# Altium project COMECA.PrjPcb
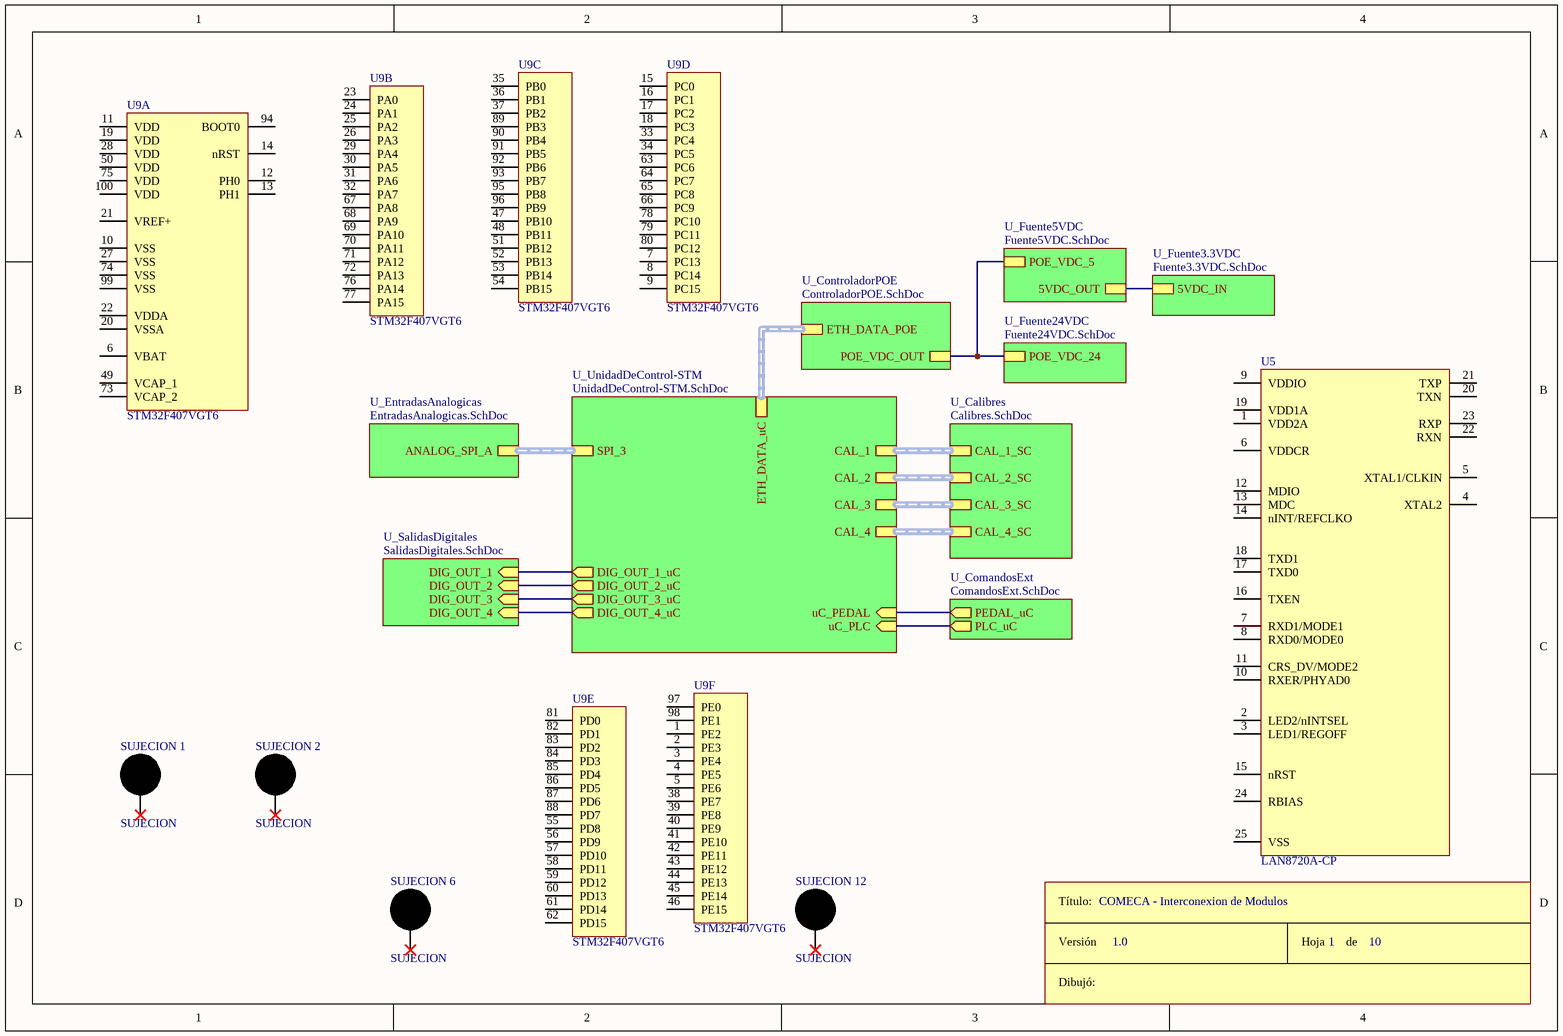
[diagram p0: COMECA_Main.SchDoc]
3 sheets, 38 parts. Net scope: hierarchical (ports join the sheet entries above them; power ports are global).
Board file: COMECA-PCBv1.PcbDoc
Sheets:
  COMECA_Main.SchDoc
    U_ControladorPOE = ControladorPOE.SchDoc
    U_ComandosExt = ComandosExt.SchDoc

## Sheet COMECA_Main.SchDoc
size A4; SheetNumber: 1; SheetTotal: 10

### Parts
ROT9  Rótulo  (value not drawn)  (graphical)
SUJECION_1  SUJECION  [SUJECION (5.00MM - 3.50MM)]
SUJECION_2  SUJECION  [SUJECION (5.00MM - 3.50MM)]
SUJECION_6  SUJECION  [SUJECION (5.00MM - 3.50MM)]
SUJECION_12  SUJECION  [SUJECION (5.00MM - 3.50MM)]
U5  LAN8720A-CP  [MC 24-QFN-PUNCH]
U9  STM32F407VGT6  [LQFP-100]  (parts A,B,C,D,E,F of 6)

### Sub-sheets
U_Calibres = Calibres.SchDoc (file not in this document): CAL_4_SC (harness CALIBRE), CAL_3_SC (harness CALIBRE), CAL_2_SC (harness CALIBRE), CAL_1_SC (harness CALIBRE)
U_ComandosExt = ComandosExt.SchDoc: PLC_uC (out), PEDAL_uC (out)
U_ControladorPOE = ControladorPOE.SchDoc: POE_VDC_OUT, ETH_DATA_POE (harness ETH_DATA)
U_EntradasAnalogicas = EntradasAnalogicas.SchDoc (file not in this document): ANALOG_SPI_A (harness ANALOG_SPI)
U_Fuente3.3VDC = Fuente3.3VDC.SchDoc (file not in this document): 5VDC_IN
U_Fuente5VDC = Fuente5VDC.SchDoc (file not in this document): POE_VDC_5, 5VDC_OUT
U_Fuente24VDC = Fuente24VDC.SchDoc (file not in this document): POE_VDC_24
U_SalidasDigitales = SalidasDigitales.SchDoc (file not in this document): DIG_OUT_4 (in), DIG_OUT_2 (in), DIG_OUT_3 (in), DIG_OUT_1 (in)
U_UnidadDeControl-STM = UnidadDeControl-STM.SchDoc (file not in this document): uC_PLC (in), uC_PEDAL (in), SPI_3 (harness ANALOG_SPI), CAL_2 (harness CALIBRE), CAL_3 (harness CALIBRE), CAL_4 (harness CALIBRE), CAL_1 (harness CALIBRE), DIG_OUT_3_uC (out), DIG_OUT_2_uC (out), DIG_OUT_1_uC (out), DIG_OUT_4_uC (out), ETH_DATA_uC (harness ETH_DATA)

### Nets
VDD: sheet U_ControladorPOE/POE_VDC_OUT, sheet U_Fuente5VDC/POE_VDC_5, sheet U_Fuente24VDC/POE_VDC_24
NetR7_1: sheet U_ComandosExt/PLC_uC, sheet U_UnidadDeControl-STM/uC_PLC
NetR10_1: sheet U_ComandosExt/PEDAL_uC, sheet U_UnidadDeControl-STM/uC_PEDAL
(unnamed): sheet U_Fuente5VDC/5VDC_OUT, sheet U_Fuente3.3VDC/5VDC_IN
(unnamed): sheet U_UnidadDeControl-STM/DIG_OUT_3_uC, sheet U_SalidasDigitales/DIG_OUT_3
(unnamed): sheet U_UnidadDeControl-STM/DIG_OUT_2_uC, sheet U_SalidasDigitales/DIG_OUT_2
(unnamed): sheet U_UnidadDeControl-STM/DIG_OUT_1_uC, sheet U_SalidasDigitales/DIG_OUT_1
(unnamed): sheet U_UnidadDeControl-STM/DIG_OUT_4_uC, sheet U_SalidasDigitales/DIG_OUT_4

Not connected (* = marked no-connect by the designer): SUJECION_1 1*; SUJECION_2 1*; SUJECION_6 1*; SUJECION_12 1*; U5 1(VDD2A) 2(LED2/nINTSEL) 3(LED1/REGOFF) 4(XTAL2) 5(XTAL1/CLKIN) 6(VDDCR) 7(RXD1/MODE1) 8(RXD0/MODE0) 9(VDDIO) 10(RXER/PHYAD0) 11(CRS_DV/MODE2) 12(MDIO) 13(MDC) 14(nINT/REFCLKO) 15(nRST) 16(TXEN) 17(TXD0) 18(TXD1) 19(VDD1A) 20(TXN) 21(TXP) 22(RXN) 23(RXP) 24(RBIAS) 25(VSS); U9 1(PE2) 2(PE3) 3(PE4) 4(PE5) 5(PE6) 6(VBAT) 7(PC13) 8(PC14) 9(PC15) 10(VSS) 11(VDD) 12(PH0) 13(PH1) 14(nRST) 15(PC0) 16(PC1) 17(PC2) 18(PC3) 19(VDD) 20(VSSA) 21(VREF+) 22(VDDA) 23(PA0) 24(PA1) 25(PA2) 26(PA3) 27(VSS) 28(VDD) 29(PA4) 30(PA5) 31(PA6) 32(PA7) 33(PC4) 34(PC5) 35(PB0) 36(PB1) 37(PB2) 38(PE7) 39(PE8) 40(PE9) 41(PE10) 42(PE11) 43(PE12) 44(PE13) 45(PE14) 46(PE15) 47(PB10) 48(PB11) 49(VCAP_1) 50(VDD) 51(PB12) 52(PB13) 53(PB14) 54(PB15) 55(PD8) 56(PD9) 57(PD10) 58(PD11) 59(PD12) 60(PD13) 61(PD14) 62(PD15) 63(PC6) 64(PC7) 65(PC8) 66(PC9) 67(PA8) 68(PA9) 69(PA10) 70(PA11) 71(PA12) 72(PA13) 73(VCAP_2) 74(VSS) 75(VDD) 76(PA14) 77(PA15) 78(PC10) 79(PC11) 80(PC12) 81(PD0) 82(PD1) 83(PD2) 84(PD3) 85(PD4) 86(PD5) 87(PD6) 88(PD7) 89(PB3) 90(PB4) 91(PB5) 92(PB6) 93(PB7) 94(BOOT0) 95(PB8) 96(PB9) 97(PE0) 98(PE1) 99(VSS) 100(VDD)

### Buses and harness runs
harness sheet U_Calibres/CAL_1_SC = sheet U_UnidadDeControl-STM/CAL_1
harness sheet U_Calibres/CAL_2_SC = sheet U_UnidadDeControl-STM/CAL_2
harness sheet U_Calibres/CAL_3_SC = sheet U_UnidadDeControl-STM/CAL_3
harness sheet U_Calibres/CAL_4_SC = sheet U_UnidadDeControl-STM/CAL_4
harness sheet U_ControladorPOE/ETH_DATA_POE = sheet U_UnidadDeControl-STM/ETH_DATA_uC
harness sheet U_EntradasAnalogicas/ANALOG_SPI_A = sheet U_UnidadDeControl-STM/SPI_3

### Notes on the sheet
- COMECA - Interconexion de Modulos
- 1.0
- 1
- 10
- (in symbol Rótulo) Título:; Versión; Hoja       de; Dibujó:

## Sheet ControladorPOE.SchDoc
size A4; SheetNumber: 8; SheetTotal: 10
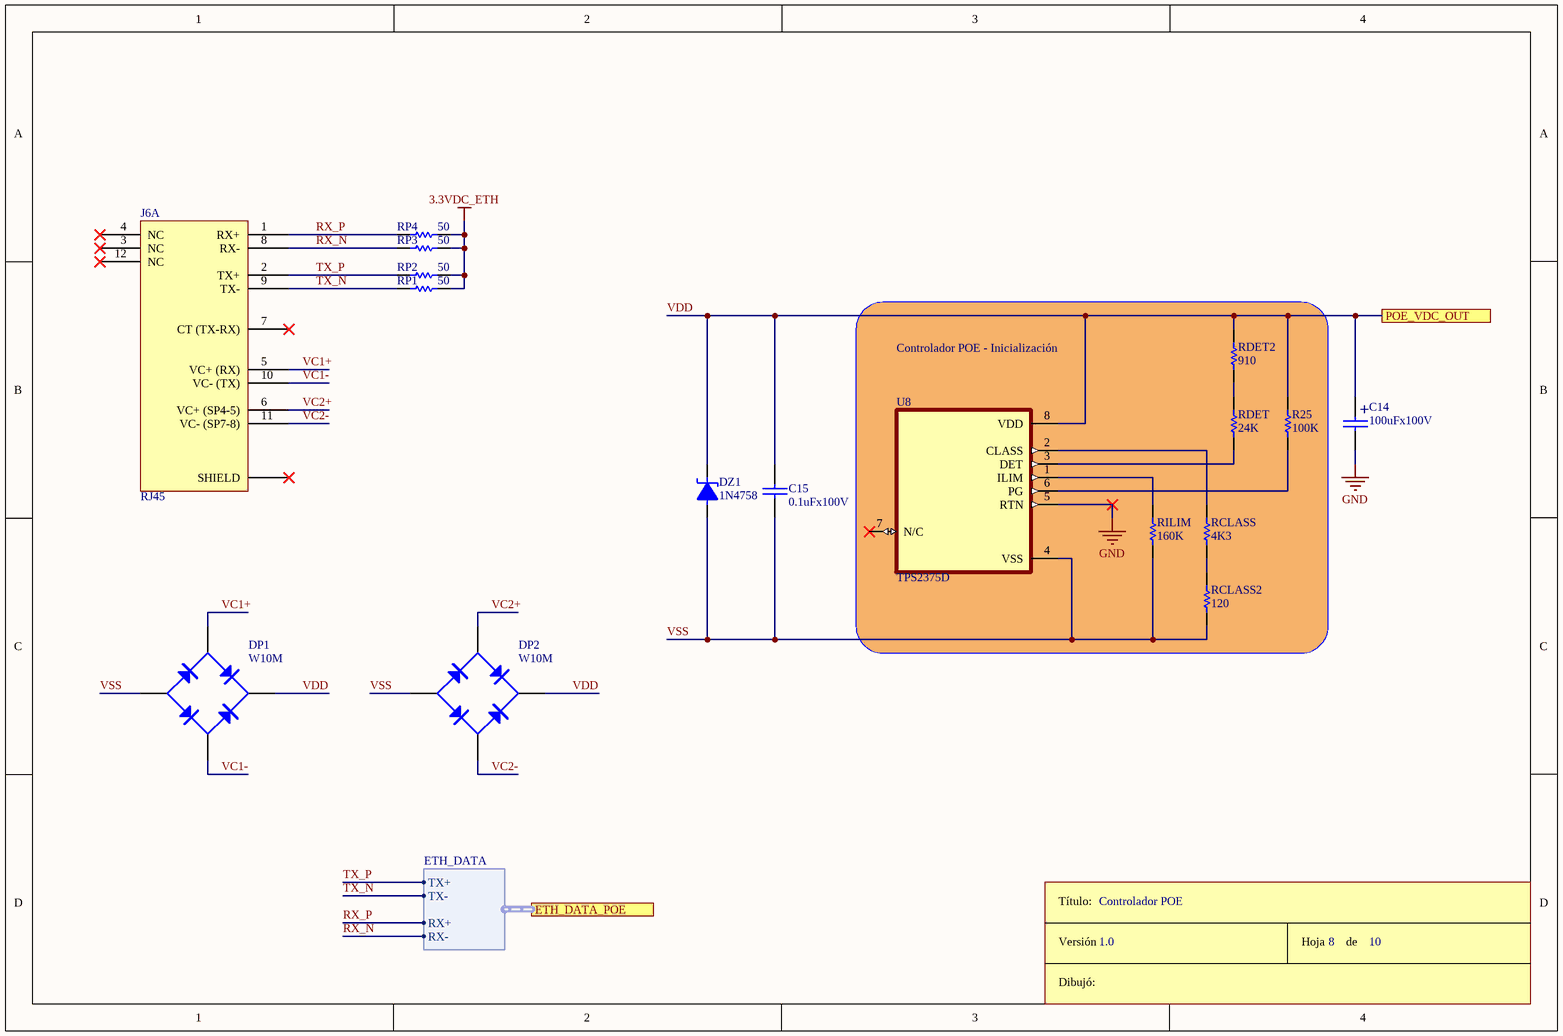
[diagram p1: ControladorPOE.SchDoc]

### Parts
C14  100uFx100V  [CAP200RP]
C15  0.1uFx100V  [CAP300v2]
DP1  W10M  [PUENTE - W10M]
DP2  W10M  [PUENTE - W10M]
DZ1  1N4758  [DO41]
J6A  RJ45  [ARJP11C-MB]
R25  100K  [RES300]
RCLASS  4K3  [RES300]
RCLASS2  120  [RES300]
RDET  24K  [RES300]
RDET2  910  [RES300]
RILIM  160K  [RES300]
ROT7  Rótulo  (value not drawn)  (graphical)
RP1  50  [RES300]
RP2  50  [RES300]
RP3  50  [RES300]
RP4  50  [RES300]
U8  TPS2375D  [SOIC127P599X175-8N]

### Blocks framed on the sheet
Controlador POE - Inicialización: R25 RCLASS RCLASS2 RDET RDET2 RILIM U8

### Ports
ETH_DATA_POE (harness ETH_DATA), POE_VDC_OUT

### Harnesses
ETH_DATA: TX+, TX-, RX+, RX-

### Nets
3.3VDC_ETH: RP1.2 RP2.2 RP3.2 RP4.2
GND: C14.2 U8.5(RTN)
RX_N: J6A.8(RX-) RP3.1 ; port ETH_DATA_POE.RX-
RX_P: J6A.1(RX+) RP4.1 ; port ETH_DATA_POE.RX+
TX_N: J6A.9(TX-) RP1.1 ; port ETH_DATA_POE.TX-
TX_P: J6A.2(TX+) RP2.1 ; port ETH_DATA_POE.TX+
VC1+: DP1.2(AC) J6A.5(VC+_(RX))
VC1-: DP1.4(AC) J6A.10(VC-_(TX))
VC2+: DP2.2(AC) J6A.6(VC+_(SP4-5))
VC2-: DP2.4(AC) J6A.11(VC-_(SP7-8))
VDD: C14.1 C15.1 DP1.1(V+) DP2.1(V+) DZ1.2 R25.2 RDET2.2 U8.8(VDD) ; port POE_VDC_OUT
VSS: C15.2 DP1.3(V-) DP2.3(V-) DZ1.1 RCLASS2.1 RILIM.1 U8.4(VSS)
NetR25_1: R25.1 U8.6(PG)
NetRCLASS_1: RCLASS.1 RCLASS2.2
NetRCLASS_2: RCLASS.2 U8.2(CLASS)
NetRDET_1: RDET.1 U8.3(DET)
NetRDET_2: RDET.2 RDET2.1
NetRILIM_2: RILIM.2 U8.1(ILIM)

Not connected (* = marked no-connect by the designer): J6A 3(NC)* 4(NC)* 7(CT_(TX-RX))* 12(NC)* SHIELD*; U8 7(N/C)*

### Notes on the sheet
- Controlador POE
- 1.0
- 8
- 10
- (in symbol CAPPOL) +
- (in symbol Rótulo) Título:; Versión; Hoja       de; Dibujó:

### Library data of the parts
C14 = CAPPOL
C15 = CAP
DP1 DP2 = W10M: Bridge Rectifier TH 1000V 1.5A
DZ1 = DIODO ZENER
J6A = ARJP11C-MBSC-L2: Magjack Connector for PoE
R25 RCLASS RCLASS2 RDET RDET2 RILIM RP1-RP4 = RES
U8 = TPS2375D: Class 3 PoE PD with latch protection 8-SOIC -40 to 85; MF: Texas Instruments; Purchase-URL: https://pricing.snapeda.com/search/part/TPS2375D/?ref=eda; MP: TPS2375D; Package: SOIC-8 Texas Instruments; SnapEDA_Link: https://www.snapeda.com/parts/TPS2375D/Texas%20Instruments/view-part/570877/?ref=snap; Value: *; Check_prices: https://www.snapeda.com/parts/TPS2375D/Texas%20Instruments/view-part/570877/?ref=eda; Digi-Key_Part_Number: 296-26922-2-ND

## Sheet ComandosExt.SchDoc
size A4; SheetNumber: 5; SheetTotal: 10
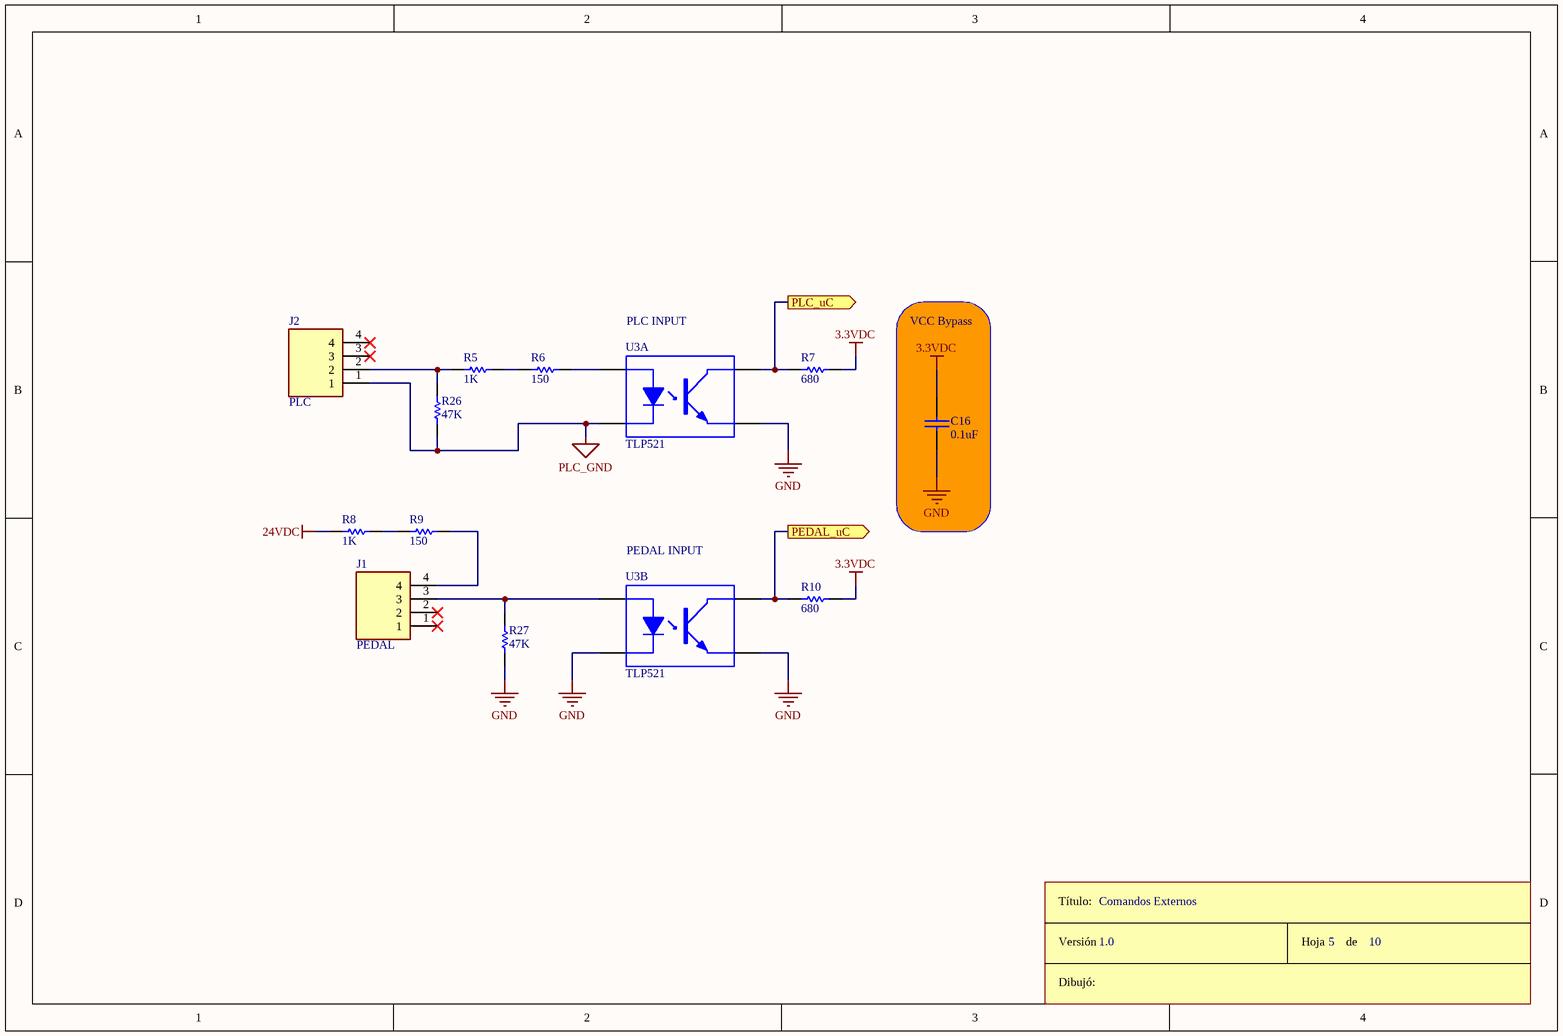
[diagram p2: ComandosExt.SchDoc]

### Parts
C16  0.1uF  [CAP100]
J1  PEDAL  [TE_1586863-4]
J2  PLC  [TE_1586863-4]
R5  1K  [RES300]
R6  150  [RES300]
R7  680  [RES300]
R8  1K  [RES300]
R9  150  [RES300]
R10  680  [RES300]
R26  47K  [RES300]
R27  47K  [RES300]
ROT3  Rótulo  (value not drawn)  (graphical)
U3  TLP521  [DIP8]  (parts A,B of 2)

### Blocks framed on the sheet
VCC Bypass: C16

### Ports
PEDAL_uC (out), PLC_uC (out)

### Nets
3.3VDC: C16.1 R7.2 R10.2
24VDC: R8.1
GND: C16.2 R27.1 U3.4(K) U3.5(E) U3.7(E)
PLC_GND: J2.1 R26.1 U3.2(K)
NetJ1_3: J1.3 R27.2 U3.3(A)
NetJ1_4: J1.4 R9.2
NetJ2_2: J2.2 R5.1 R26.2
NetR5_2: R5.2 R6.1
NetR6_2: R6.2 U3.1(A)
NetR7_1: R7.1 U3.8(C) ; port PLC_uC
NetR8_2: R8.2 R9.1
NetR10_1: R10.1 U3.6(C) ; port PEDAL_uC

Not connected (* = marked no-connect by the designer): J1 1* 2*; J2 3* 4*

### Notes on the sheet
- (near U3) PLC INPUT
- (near U3) PEDAL INPUT
- Comandos Externos
- 1.0
- 5
- 10
- (in symbol Rótulo) Título:; Versión; Hoja       de; Dibujó:

### Library data of the parts
C16 = CAP
J1 J2 = 1586863-4: Conn Power HDR 4 POS 4.2mm Solder RA Thru-Hole 4 Terminal 1 Port Tray; MF: TE Connectivity; Price: None; Value: *; TE_purchase_URL: https://www.te.com/usa-en/product-1586863-4.html?te_bu=Cor&te_type=disp&te_campaign=seda_glo_cor-seda-global-disp-prtnr-fy19-seda-model-bom-cta_sma-317_1&elqCampaignId=32493; SnapEDA_Link: https://www.snapeda.com/parts/1586863-4/TE%20Connectivity%20AMP%20Connectors/view-part/1401879/?ref=snap; Package: None; EU_RoHS_Compliance: Compliant; Availability: Unavailable; MP: 1586863-4
R5-R10 R26 R27 = RES
U3 = TLP521-2: PhotoCoupler

## Nets that join several sheets
GND: ControladorPOE (C14.2 U8.5), ComandosExt (5 pins)